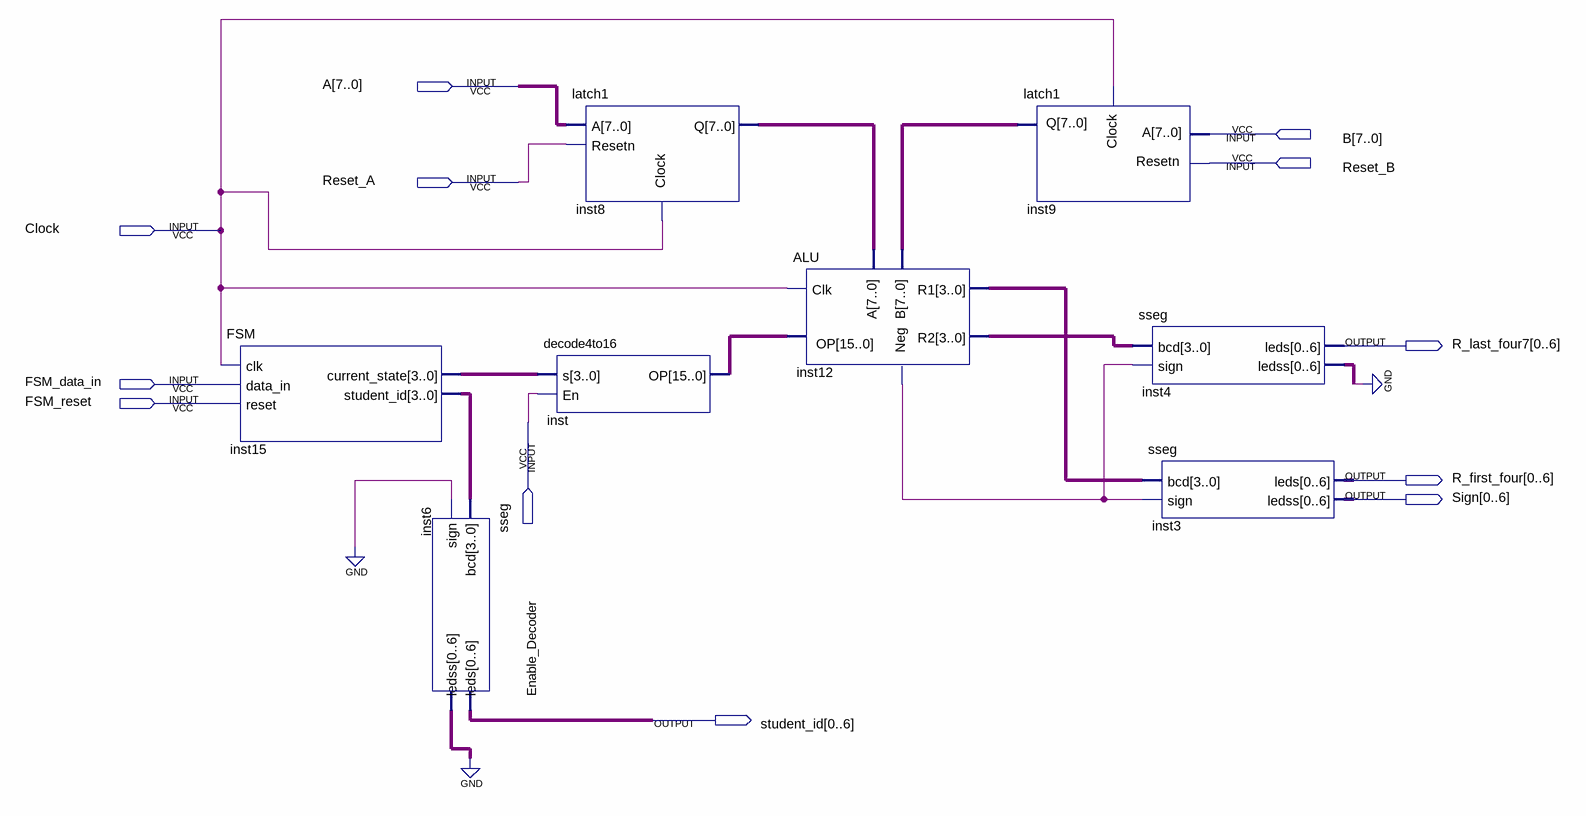
[diagram p0: schematic sheet]
// Quartus schematic Problem1Block.bdf as structural Verilog: 8 symbols, 12 pins
module Problem1Block (
  input  [7:0] A,
  input  [7:0] B,
  input  Reset_B,
  input  Reset_A,
  input  Clock,
  input  FSM_data_in,
  input  FSM_reset,
  input  Enable_Decoder,
  output [0:6] R_last_four7,
  output [0:6] R_first_four,
  output [0:6] Sign,
  output [0:6] student_id
);

  wire inst12_neg;
  wire [3:0] inst12_r1, inst12_r2, inst15_current_state, inst15_student_id;
  wire [6:0] inst4_ledss, inst6_ledss;
  wire [7:0] inst8_q, inst9_q;
  wire [15:0] inst_op;

  FSM inst15 (
    .clk(Clock), .data_in(FSM_data_in), .reset(FSM_reset), .student_id(inst15_student_id),
    .current_state(inst15_current_state));
  sseg inst6 (.bcd(inst15_student_id), .sign(1'b0), .leds(student_id), .ledss(inst6_ledss));
  decode4to16 inst (.s(inst15_current_state), .En(Enable_Decoder), .OP(inst_op));
  latch1 inst8 (.A(A), .Resetn(Reset_A), .Clock(Clock), .Q(inst8_q));
  ALU inst12 (.Clk(Clock), .A(inst8_q), .B(inst9_q), .OP(inst_op), .Neg(inst12_neg), .R1(inst12_r1), .R2(inst12_r2));
  latch1 inst9 (.A(B), .Resetn(Reset_B), .Clock(Clock), .Q(inst9_q));
  sseg inst4 (.bcd(inst12_r2), .sign(inst12_neg), .leds(R_last_four7), .ledss(inst4_ledss));
  sseg inst3 (.bcd(inst12_r1), .sign(inst12_neg), .leds(R_first_four), .ledss(Sign));
  // also tied to GND on the sheet: {inst6_ledss[0], inst6_ledss[1], inst6_ledss[2], inst6_ledss[3], inst6_ledss[4], inst6_ledss[5], inst6_ledss[6]}
endmodule
